# Altium project Power_Board.PrjPcb (part 3 of 3)

## Sheet Ethernet.SchDoc: =SheetTitle
size B; SheetTitle: W5500 Ethernet Controller; DrawnBy: Samyar Sadat Akhavi; SheetNumber: 7; SheetTotal: 19
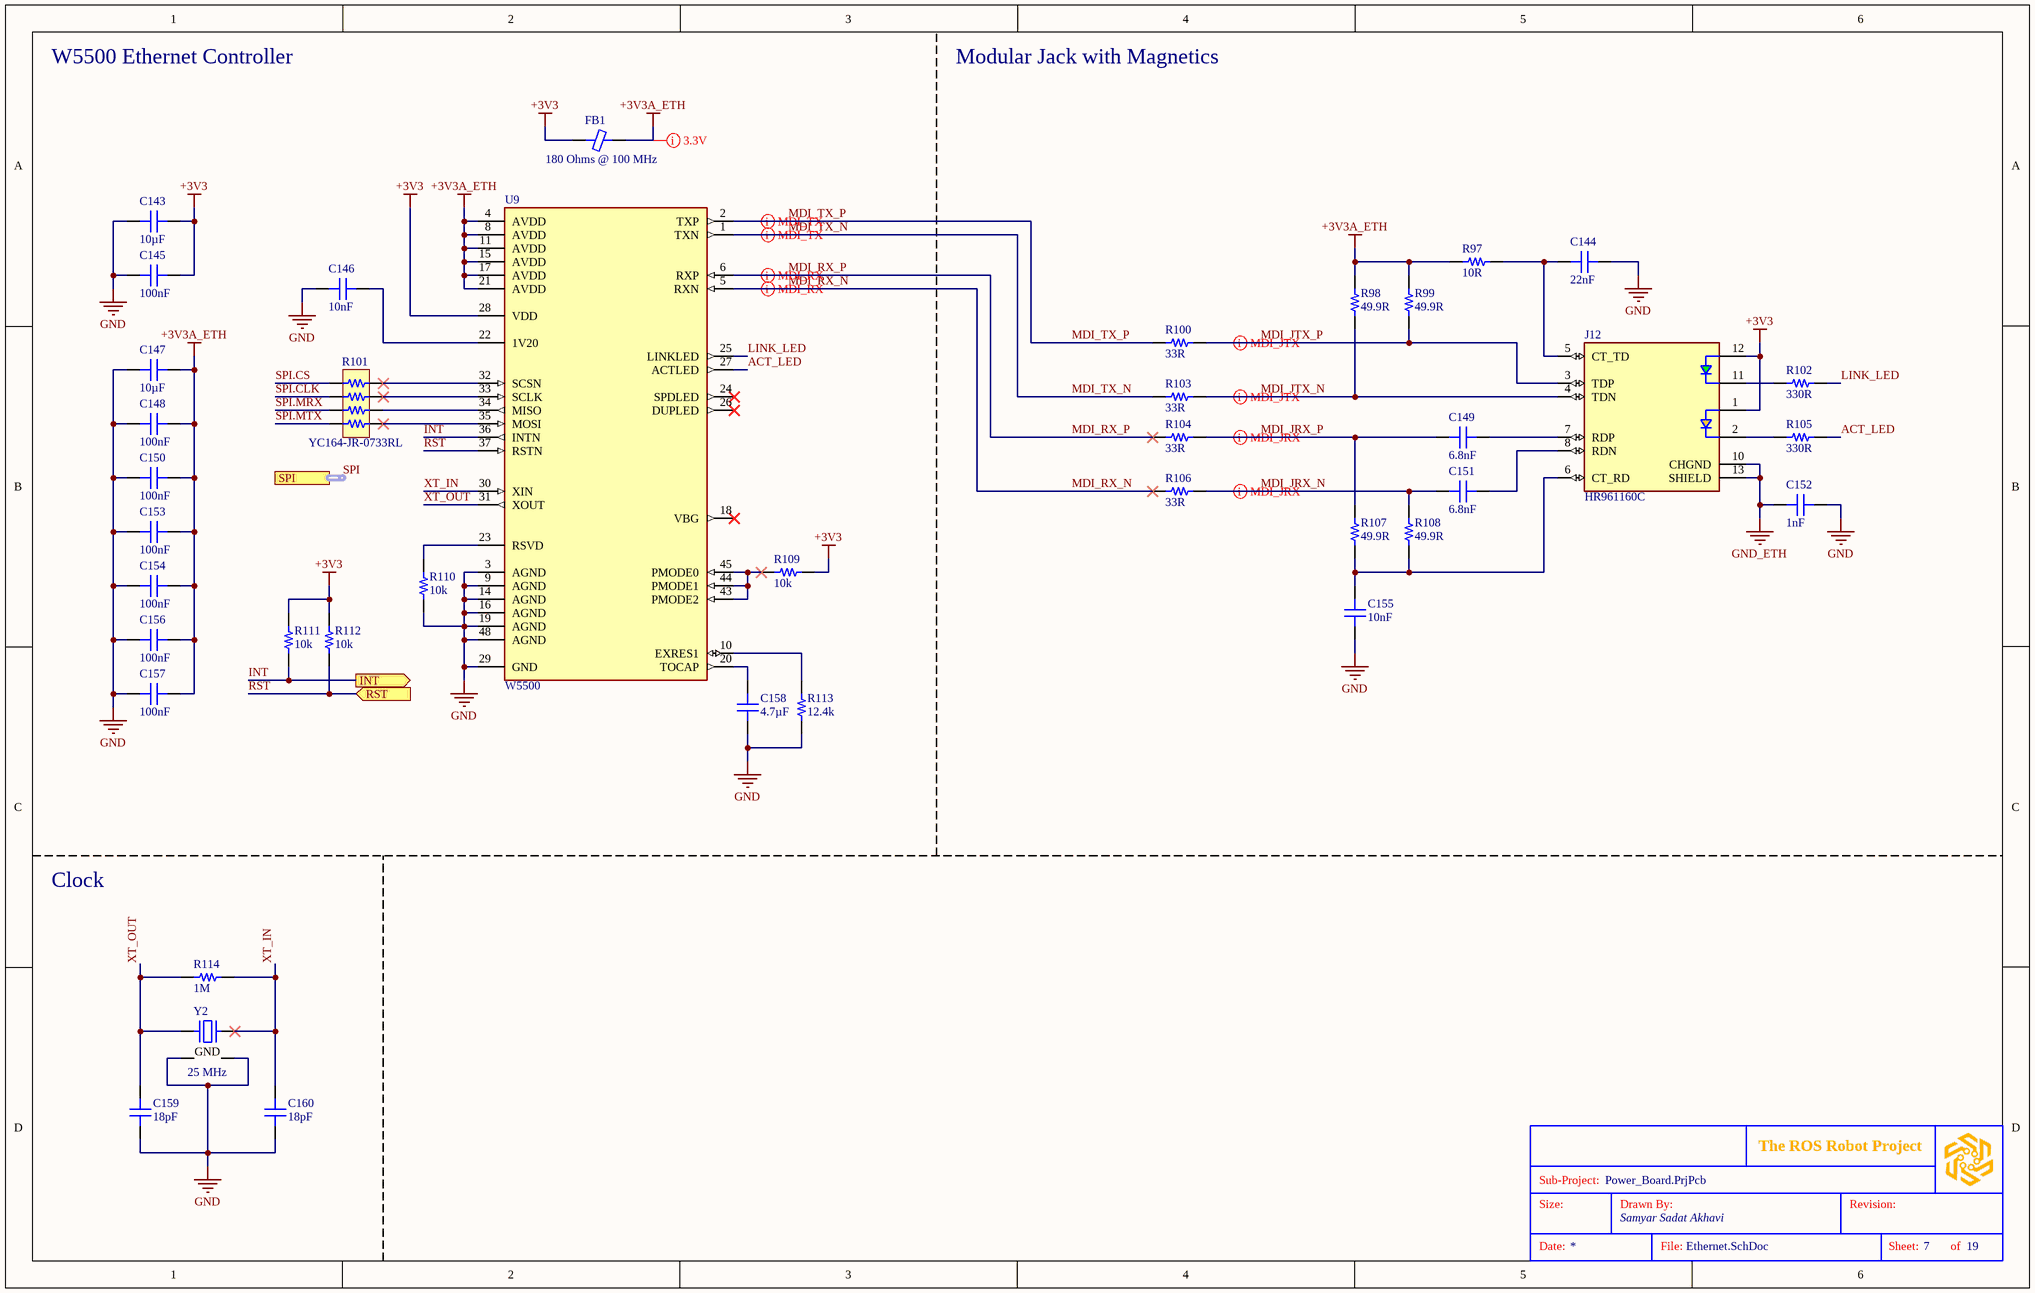
[diagram p14: Ethernet.SchDoc]

### Parts
(Parts that share a designator on the sheet are numbered #1, #2 ... from top to bottom, then left to right.)
?#12  (no value)  (graphical)
C143  10µF  [CAP 1206_3216]
C144  22nF  [CAP 0603_1608]
C145  100nF  [CAP 0603_1608]
C146  10nF  [CAP 0603_1608]
C147  10µF  [CAP 1206_3216]
C148  100nF  [CAP 0603_1608]
C149  6.8nF  [CAP 0603_1608]
C150  100nF  [CAP 0603_1608]
C151  6.8nF  [CAP 0603_1608]
C152  1nF  [CAP 1206_3216]
C153  100nF  [CAP 0603_1608]
C154  100nF  [CAP 0603_1608]
C155  10nF  [CAP 0603_1608]
C156  100nF  [CAP 0603_1608]
C157  100nF  [CAP 0603_1608]
C158  4.7µF  [CAP 0603_1608]
C159  18pF  [CAP 0603_1608]
C160  18pF  [CAP 0603_1608]
FB1  180 Ohms @ 100 MHz  [FER 0603_1608]
J12  HR961160C  [HANRUN_HR961160C]
R97  10R  [RES 0603_1608]
R98  49.9R  [RES 0603_1608]
R99  49.9R  [RES 0603_1608]
R100  33R  [RES 0603_1608]
R101  YC164-JR-0733RL  [RESNET 1206-8 CONVEX]
R102  330R  [RES 0603_1608]
R103  33R  [RES 0603_1608]
R104  33R  [RES 0603_1608]
R105  330R  [RES 0603_1608]
R106  33R  [RES 0603_1608]
R107  49.9R  [RES 0603_1608]
R108  49.9R  [RES 0603_1608]
R109  10k  [RES 0603_1608]
R110  10k  [RES 0603_1608]
R111  10k  [RES 0603_1608]
R112  10k  [RES 0603_1608]
R113  12.4k  [RES 0603_1608]
R114  1M  [RES 0603_1608]
U9  W5500  [48LQFP_W5500_WIZ]
Y2  25 MHz  [EPSON TSX-3225]

### Ports
INT (out, see Power_Board[3B]), RST (in, see Power_Board[3B]), SPI (harness SPI_FD, see Power_Board[3B])

### Nets
+3V3: C143.2 C145.1 FB1.1 J12.1(YLW_A) J12.12(GRN_A) R109.1 R111.2 R112.1 U9.28(VDD)
+3V3A_ETH: C147.2 C148.1 C150.1 C153.1 C154.1 C156.1 C157.1 FB1.2 R97.2 R98.2 R99.2 U9.4(AVDD) U9.8(AVDD) U9.11(AVDD) U9.15(AVDD) U9.17(AVDD) U9.21(AVDD)
GND: C143.1 C144.2 C145.2 C146.2 C147.1 C148.2 C150.2 C152.1 C153.2 C154.2 C155.2 C156.2 C157.2 C158.1 C159.1 C160.1 R110.2 R113.1 U9.3(AGND) U9.9(AGND) U9.14(AGND) U9.16(AGND) U9.19(AGND) U9.29(GND) U9.48(AGND) Y2.2(GND) Y2.4(GND)
GND_ETH: C152.2 J12.10(CHGND) J12.13(SHIELD)
ACT_LED: R105.2 U9.27(ACTLED)
INT: R111.1 U9.36(INTN) ; port INT
LINK_LED: R102.2 U9.25(LINKLED)
MDI_JRX_N: C151.1 R106.2 R108.2
MDI_JRX_P: C149.2 R104.2 R107.2
MDI_JTX_N: J12.4(TDN) R98.1 R103.2
MDI_JTX_P: J12.3(TDP) R99.1 R100.2
MDI_RX_N: R106.1 U9.5(RXN)
MDI_RX_P: R104.1 U9.6(RXP)
MDI_TX_N: R103.1 U9.1(TXN)
MDI_TX_P: R100.1 U9.2(TXP)
RST: R112.2 U9.37(RSTN) ; port RST
SPI.CLK: R101.2
SPI.CS: R101.1
SPI.MRX: R101.3
SPI.MTX: R101.4
XT_IN: C160.2 R114.2 U9.30(XIN) Y2.3
XT_OUT: C159.2 R114.1 U9.31(XOUT) Y2.1
NetC144_1: C144.1 J12.5(CT_TD) R97.1
NetC146_1: C146.1 U9.22(1V20)
NetC149_1: C149.1 J12.7(RDP)
NetC151_2: C151.2 J12.8(RDN)
NetC155_1: C155.1 J12.6(CT_RD) R107.1 R108.1
NetC158_2: C158.2 U9.20(TOCAP)
NetJ12_2: J12.2(YLW_K) R105.1
NetJ12_11: J12.11(GRN_K) R102.1
NetR101_5: R101.5 U9.35(MOSI)
NetR101_6: R101.6 U9.34(MISO)
NetR101_7: R101.7 U9.33(SCLK)
NetR101_8: R101.8 U9.32(SCSN)
NetR109_2: R109.2 U9.43(PMODE2) U9.44(PMODE1) U9.45(PMODE0)
NetR110_1: R110.1 U9.23(RSVD)
NetR113_2: R113.2 U9.10(EXRES1)

Not connected (* = marked no-connect by the designer): U9 18(VBG)* 24(SPDLED)* 26(DUPLED)*

### Buses and harness runs
harness SPI = port SPI

### Layout directives
differential pair: MDI_JRX_N, MDI_JRX_P, MDI_JTX_N, MDI_JTX_P, MDI_RX_N, MDI_RX_P, MDI_TX_N, MDI_TX_P
rule Supply Nets [Voltage = 3.300]: +3V3A_ETH

### Notes on the sheet
- W5500 Ethernet Controller
- Modular Jack with Magnetics
- Clock
- Sub-Project:
- Size:
- Drawn By:
- Revision:
- Date:
- File:
- Sheet:
- of

### Library data of the parts
?#12 = SGR-STDTBSB: STANDARD SCHEMATICS TITLE BLOCK
C143 C147 = GEN-CC10UT10V25KX7R1206: GENERIC 1206 MLC CAPACITOR; Tolerance: ±10%; Voltage: 25V; Dielectric: X7R; Part Number: GEN-CC10UT10V25KX7R1206; Value: 10µF
C144 = GEN-CC22NT20V25KX7R603: GENERIC 0603 MLC CAPACITOR; Tolerance: ±20%; Voltage: 25V; Dielectric: X7R; Part Number: GEN-CC22NT20V25KX7R603; Value: 22nF
C145 C148 C150 C153 C154 C156 C157 = GEN-CC100NT10V50KX7R603: GENERIC 0603 MLC CAPACITOR; Tolerance: ±10%; Voltage: 50V; Dielectric: X7R; Part Number: GEN-CC100NT10V50KX7R603; Value: 100nF
C146 C155 = GEN-CC10NT10V50KX7R603: GENERIC 0603 MLC CAPACITOR; Tolerance: ±10%; Voltage: 50V; Dielectric: X7R; Part Number: GEN-CC10NT10V50KX7R603; Value: 10nF
C149 C151 = GEN-CC6N8T10V50KX7R603: GENERIC 0603 MLC CAPACITOR; Tolerance: ±10%; Voltage: 50V; Dielectric: X7R; Part Number: GEN-CC6N8T10V50KX7R603; Value: 6.8nF
C152 = GEN-CC1NT10V2000KX7R1206: GENERIC 1206 MLC CAPACITOR; Tolerance: ±10%; Voltage: 2000V; Dielectric: X7R; Part Number: GEN-CC1NT10V2000KX7R1206; Value: 1nF
C158 = GEN-CC4U7T106V3KX7R603: GENERIC 0603 MLC CAPACITOR; Tolerance: ±10%; Voltage: 6.3V; Dielectric: X7R; Part Number: GEN-CC4U7T106V3KX7R603; Value: 4.7µF
C159 C160 = GEN-CC18PT5V50KC0G603: GENERIC 0603 MLC CAPACITOR; Tolerance: ±5%; Voltage: 50V; Dielectric: C0G; Part Number: GEN-CC18PT5V50KC0G603; Value: 18pF
FB1 = MPZ1608S181ATAH0: FERRITE BEAD 180 OHM 0603 1LN; Manufacturer: TDK Corporation; Current Rating (Max): 2A; DC Resistance (DCR) (Max): 50mOhm; Filter Type: Power Line; Number of Lines: 1; Part Number: MPZ1608S181ATAH0; ComponentLink1Description: Datasheet; ComponentLink1URL: https://product.tdk.com/info/en/catalog/datasheets/beads_commercial_power_mpz1608_en.pdf?ref_disty=digikey; ComponentLink2Description: DigiKey Link; ComponentLink2URL: https://www.digikey.com/en/products/detail/tdk-corporation/MPZ1608S181ATAH0/2117944; Device Package: 0603 (1608 Metric); Height (Max): 0.030" (0.75mm); Impedance @ Frequency: 180 Ohms @ 100 MHz; LastUpdated: 4/5/2026 8:28:05 PM; Lifecycle Status: Active; Minimum Order: 1; Mounting Type: Surface Mount; Operating Temperature: -55°C ~ 125°C; Package / Case: 0603 (1608 Metric); Packaging: TapeAndReel; PartId: 1025; Part Status: Active; Price: 0.02; Series: MPZ; Size / Dimension: 0.063" L x 0.031" W (1.60mm x 0.80mm); Supplier 1: DigiKey; Supplier Part Number 1: 445-MPZ1608S181ATAH0CT-ND; Value: 180 Ohms @ 100 MHz
J12 = HR961160C: MAGJACK SMT R/A 8P8C RJ45 ETHERNET; Manufacturer: HanRun; Part Number: HR961160C; Supplier 1: Ozdisan; Supplier Part Number 1: HR961160C
R97 = GEN-CRR10T1P8603: GENERIC 0603 CHIP RESISTOR; Tolerance: ±1%; Power: 0.125W; Part Number: GEN-CRR10T1P8603; Value: 10R
R98 R99 R107 R108 = GEN-CRR49R9T1P8603: GENERIC 0603 CHIP RESISTOR; Tolerance: ±1%; Power: 0.125W; Part Number: GEN-CRR49R9T1P8603; Value: 49.9R
R100 R103 R104 R106 = GEN-CRR33T1P8603: GENERIC 0603 CHIP RESISTOR; Tolerance: ±1%; Power: 0.125W; Part Number: GEN-CRR33T1P8603; Value: 33R
R101 = YC164-JR-0733RL: RES ARRAY 4 RES 33 OHM 1206; Manufacturer: Yageo; Circuit Type: Isolated; Number of Resistors: 4; Power Per Element: 62.5mW; Resistance (Ohms): 33; Temperature Coefficient: ±200ppm/°C; Tolerance: ±5%; Part Number: YC164-JR-0733RL; Applications: DDRAM, SDRAM; ComponentLink1Description: Datasheet; ComponentLink1URL: https://www.yageo.com/upload/media/product/productsearch/datasheet/rchip/PYu-YC_TC_group_51_RoHS_L_9.pdf; ComponentLink2Description: DigiKey Link; ComponentLink2URL: http://digikey.com/product-detail/en/yageo/YC164-JR-0733RL/YC164J-33CT-ND/1005642; Height - Seated (Max): 0.028" (0.70mm); LastUpdated: 9/2/2020 1:23:24 AM; Lifecycle Status: Active; Minimum Order: 1; Mounting Type: Surface Mount; Number of Pins: 8; Operating Temperature: -55°C ~ 155°C; Package / Case: 1206 (3216 Metric), Convex, Long Side Terminals; Packaging: TapeAndReel; PartId: 145; Part Status: Active; Price: 0.01; Series: YC164; Size / Dimension: 0.126" L x 0.063" W (3.20mm x 1.60mm); Supplier 1: DigiKey; Supplier Part Number 1: YC164J-33CT-ND
R102 R105 = GEN-CRR330T5P8603: GENERIC 0603 CHIP RESISTOR; Tolerance: ±5%; Power: 0.125W; Part Number: GEN-CRR330T5P8603; Value: 330R
R109-R112 = GEN-CRR10KT1P8603: GENERIC 0603 CHIP RESISTOR; Tolerance: ±1%; Power: 0.125W; Part Number: GEN-CRR10KT1P8603; Value: 10k
R113 = GEN-CRR12K4T1P8603: GENERIC 0603 CHIP RESISTOR; Tolerance: ±1%; Power: 0.125W; Part Number: GEN-CRR12K4T1P8603; Value: 12.4k
R114 = GEN-CRR1MT5P8603: GENERIC 0603 CHIP RESISTOR; Tolerance: ±5%; Power: 0.125W; Part Number: GEN-CRR1MT5P8603; Value: 1M
U9 = W5500: IC CTLR 3-1 ETH TCP/IP 48LQFP; Manufacturer: WIZnet; Copyright: Copyright (C) 2025 Ultra Librarian. All rights reserved.; Part Number: W5500; Supplier 1: DigiKey; Supplier Part Number 1: 1278-W5500CT-ND
Y2 = TSX-3225 25.0000MF20P-C0: CRYSTAL 25.0000MHZ 18PF SMD; Manufacturer: EPSON; ESR (Equivalent Series Resistance): 40 Ohms; Frequency Stability: ±20ppm; Frequency Tolerance: ±10ppm; Operating Mode: Fundamental; Part Number: TSX-3225 25.0000MF20P-C0; ComponentLink1Description: Datasheet; ComponentLink1URL: https://support.epson.biz/td/api/doc_check.php?dl=brief_TSX-3225&lang=en; ComponentLink2Description: DigiKey Link; ComponentLink2URL: https://www.digikey.com/en/products/detail/epson/TSX-3225-25-0000MF20P-C0/7430947; Frequency: 25 MHz; Height - Seated (Max): 0.024" (0.60mm); LastUpdated: 4/5/2026 8:41:19 PM; Lifecycle Status: Active; Load Capacitance: 18pF; Minimum Order: 1; Mounting Type: Surface Mount; Operating Temperature: -20°C ~ 85°C; Package / Case: 4-SMD, No Lead; Packaging: TapeAndReel; PartId: 447; Part Status: Active; Price: 0.21; Series: TSX-3225; Size / Dimension: 0.126" L x 0.098" W (3.20mm x 2.50mm); Supplier 1: DigiKey; Supplier Part Number 1: SER4212CT-ND; Type: MHz Crystal; Value: 25 MHz

## Sheet External_SSR.SchDoc: =SheetTitle
size A4; SheetTitle: External SSR Triggers; DrawnBy: Samyar Sadat Akhavi; SheetNumber: 8; SheetTotal: 19
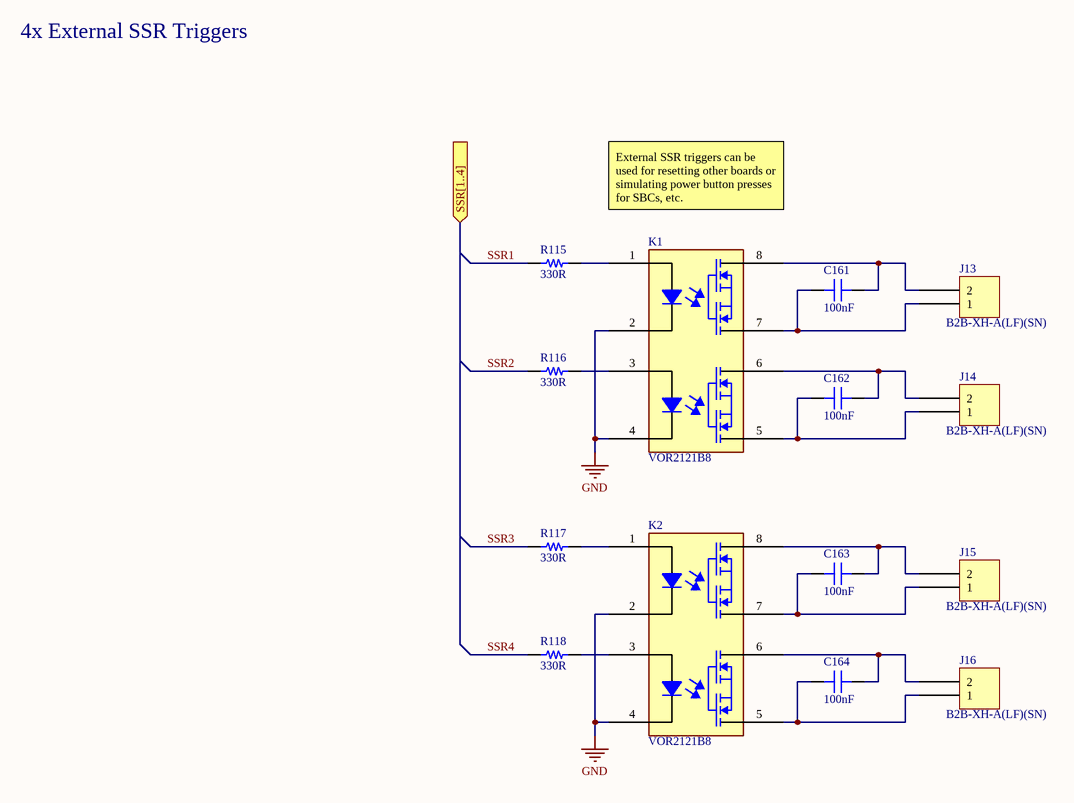
[diagram p15: External_SSR.SchDoc]

### Parts
(Parts that share a designator on the sheet are numbered #1, #2 ... from top to bottom, then left to right.)
?#13  (no value)  (graphical)
C161  100nF  [CAP 0603_1608]
C162  100nF  [CAP 0603_1608]
C163  100nF  [CAP 0603_1608]
C164  100nF  [CAP 0603_1608]
J13  B2B-XH-A(LF)(SN)  [JST XH B2B-XH-A]
J14  B2B-XH-A(LF)(SN)  [JST XH B2B-XH-A]
J15  B2B-XH-A(LF)(SN)  [JST XH B2B-XH-A]
J16  B2B-XH-A(LF)(SN)  [JST XH B2B-XH-A]
K1  VOR2121B8  [SMD-8_VOR2121B_VIS]
K2  VOR2121B8  [SMD-8_VOR2121B_VIS]
R115  330R  [RES 0603_1608]
R116  330R  [RES 0603_1608]
R117  330R  [RES 0603_1608]
R118  330R  [RES 0603_1608]

### Ports
SSR[1..4] (in, see Power_Board[3B], Microcontroller[3B])

### Nets
GND: K1.2 K1.4 K2.2 K2.4
SSR1: R115.1
SSR2: R116.1
SSR3: R117.1
SSR4: R118.1
NetC161_1: C161.1 J13.2 K1.8
NetC161_2: C161.2 J13.1 K1.7
NetC162_1: C162.1 J14.2 K1.6
NetC162_2: C162.2 J14.1 K1.5
NetC163_1: C163.1 J15.2 K2.8
NetC163_2: C163.2 J15.1 K2.7
NetC164_1: C164.1 J16.2 K2.6
NetC164_2: C164.2 J16.1 K2.5
NetK1_1: K1.1 R115.2
NetK1_3: K1.3 R116.2
NetK2_1: K2.1 R117.2
NetK2_3: K2.3 R118.2

### Notes on the sheet
- 4x External SSR Triggers
- External SSR triggers can be used for resetting other boards or simulating power button presses for SBCs, etc.
- Sub-Project:
- Size:
- Drawn By:
- Revision:
- Date:
- File:
- Sheet:
- of

### Library data of the parts
?#13 = SGR-STDTBSA4: STANDARD SCHEMATICS TITLE BLOCK
C161-C164 = GEN-CC100NT10V50KX7R603: as C145 on sheet Ethernet; Part Number: GEN-CC100NT10V50KX7R603; Value: 100nF
J13-J16 = B2B-XH-A(LF)(SN): CONN HEADER VERT 2POS 2.5MM; Manufacturer: JST Sales America Inc.; Contact Length - Post: 0.134" (3.40mm); Current Rating (Amps): 3A; Material Flammability Rating: UL94 V-0; Number of Positions: 2; Number of Positions Loaded: All; Pitch - Mating: 0.098" (2.50mm); Shrouding: Shrouded - 4 Wall; Style: Board to Cable/Wire; Voltage Rating: 250V; Part Number: B2B-XH-A(LF)(SN); ComponentLink1Description: Datasheet; ComponentLink1URL: http://www.jst-mfg.com/product/pdf/eng/eXH.pdf; ComponentLink2Description: DigiKey Link; ComponentLink2URL: http://digikey.com/product-detail/en/jst-sales-america-inc/B2B-XH-A-LF-SN/455-2247-ND/1651045; Connector Type: Header; Contact Finish - Mating: Tin; Contact Finish - Post: Tin; Contact Material: Brass; Contact Shape: Square; Contact Type: Male Pin; Fastening Type: Detent Lock; Insulation Color: Natural; Insulation Height: 0.276" (7.00mm); Insulation Material: Polyamide (PA66), Nylon 6/6; LastUpdated: 1/12/2020 11:46:08 PM; Lifecycle Status: Active; Minimum Order: 1; Mounting Type: Through Hole; Number of Rows: 1; Operating Temperature: -25°C ~ 85°C; Packaging: Bulk; PartId: 67; Part Status: Active; Price: 0.15; Series: XH; Supplier 1: DigiKey; Supplier Part Number 1: 455-2247-ND; Termination: Press-Fit, Solder
K1 K2 = VOR2121B8: SSR RELAY SPST-NO 200MA 0-250V; Manufacturer: Vishay Semiconductor Opto Division; Copyright: Copyright (C) 2026 Ultra Librarian. All rights reserved.; Part Number: VOR2121B8; Supplier 1: DigiKey; Supplier Part Number 1: VOR2121B8-ND
R115-R118 = GEN-CRR330T5P8603: as R102 on sheet Ethernet; Part Number: GEN-CRR330T5P8603; Value: 330R

## Sheet VBAT_Output.SchDoc: =SheetTitle
size A4; SheetTitle: Protected VBAT Output; DrawnBy: Samyar Sadat Akhavi; SheetNumber: 9; SheetTotal: 19
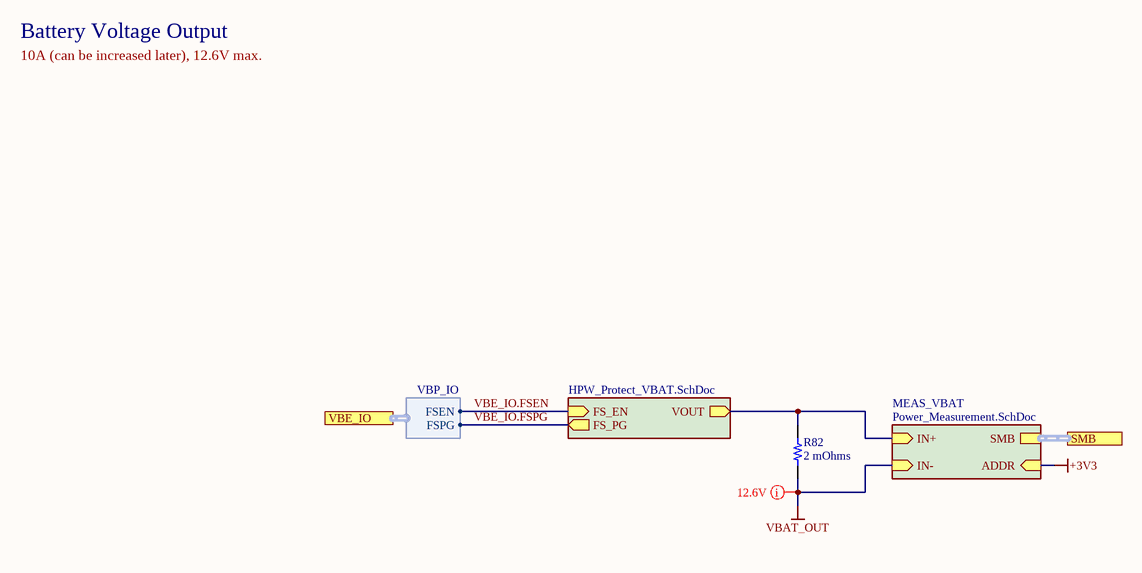
[diagram p16: VBAT_Output.SchDoc]

### Parts
(Parts that share a designator on the sheet are numbered #1, #2 ... from top to bottom, then left to right.)
?#14  (no value)  (graphical)
R82  2 mOhms  [STACKPOLE CSR2512]

### Sub-sheets
MEAS_VBAT = Power_Measurement.SchDoc: SMB (harness SMBus), ADDR (in), IN+ (in), IN- (in)
VBAT_OUT = HPW_Protect_VBAT.SchDoc: VOUT (out), FS_EN (in), FS_PG (out)

### Ports
SMB (harness SMBus, see Power_Board[3A], Battery_Input[4A], Power_Measurement[3B]), VBE_IO (harness VBP_IO, see Power_Board[3A], Microcontroller[4A])

### Harnesses
VBP_IO: FSEN, FSPG

### Nets
VBAT_OUT: R82.1 ; sheet MEAS_VBAT/IN-
VBE_IO.FSEN: sheet VBAT_OUT/FS_EN, port VBE_IO.FSEN
VBE_IO.FSPG: sheet VBAT_OUT/FS_PG, port VBE_IO.FSPG
VOUT: R82.2 ; sheet MEAS_VBAT/IN+, sheet VBAT_OUT/VOUT

### Buses and harness runs
harness port SMB = sheet MEAS_VBAT/SMB

### Layout directives
rule Supply Nets [Voltage = 12.60]: VBAT_OUT

### Notes on the sheet
- Battery Voltage Output
- 10A (can be increased later), 12.6V max.
- Sub-Project:
- Size:
- Drawn By:
- Revision:
- Date:
- File:
- Sheet:
- of

### Library data of the parts
?#14 = SGR-STDTBSA4: STANDARD SCHEMATICS TITLE BLOCK
R82 = TLR3A20DR002FTDG: RES 0.002 OHM 1% 2W 2512; Manufacturer: TE Connectivity Passive Product; Temperature Coefficient: ±50ppm/°C; Part Number: TLR3A20DR002FTDG; Package / Case: 2512 (6432 Metric); ComponentLink1Description: Datasheet; ComponentLink1URL: https://www.te.com/commerce/DocumentDelivery/DDEController?Action=srchrtrv&DocNm=1773449-3&DocType=DS&DocLang=English; ComponentLink2Description: DigiKey Link; ComponentLink2URL: http://digikey.com/product-detail/en/te-connectivity-passive-product/TLR3A20DR002FTDG/A129566CT-ND/8566770; Composition: Metal Foil; Device Package: 2512 (6432 Metric); Features: Current Sense; Height - Seated (Max): 0.024" (0.60mm); LastUpdated: 9/2/2020 1:18:06 AM; Lifecycle Status: Active; Minimum Order: 1; Number of Terminations: 2; Operating Temperature: -55°C ~ 170°C; Packaging: TapeAndReel; PartId: 1492; Part Status: Active; Power (Watts): 2W; Price: 0.30; Resistance: 2 mOhms; Series: TLR, CGS; Size / Dimension: 0.252" L x 0.126" W (6.40mm x 3.20mm); Supplier 1: DigiKey; Supplier Part Number 1: A129566CT-ND; Supplier Device Package: 2512; Tolerance: ±1%; Value: 2 mOhms

## Sheet HPW_Protect_VBAT.SchDoc: =SheetTitle
size A4; SheetTitle: High-power Bus Protection; DrawnBy: Samyar Sadat Akhavi; SheetNumber: 10; SheetTotal: 19
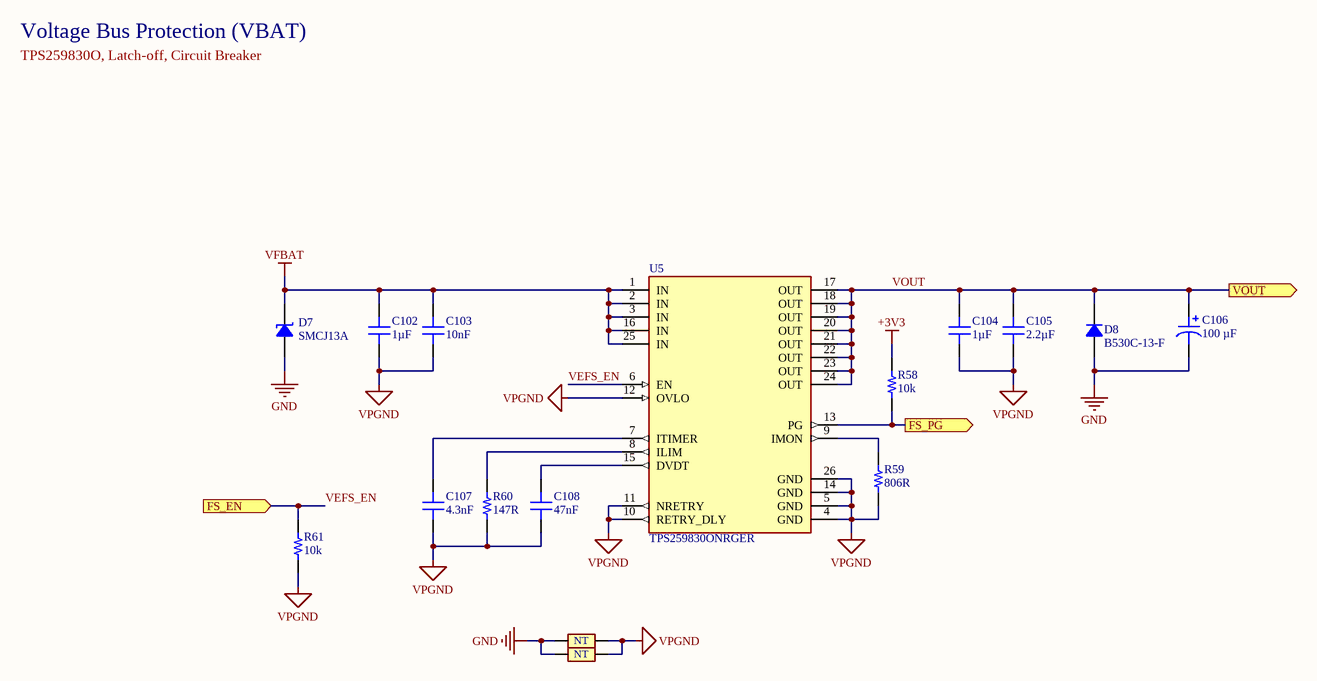
[diagram p17: HPW_Protect_VBAT.SchDoc]

### Parts
(Parts that share a designator on the sheet are numbered #1, #2 ... from top to bottom, then left to right.)
?#15  (no value)  (graphical)
C102  1µF  [CAP 0603_1608]
C103  10nF  [CAP 0603_1608]
C104  1µF  [CAP 0603_1608]
C105  2.2µF  [CAP 0805_2012]
C106  100 µF  [CAP ALSMD 6.6MM H7.7MM]
C107  4.3nF  [CAP 0603_1608]
C108  47nF  [CAP 0603_1608]
D7  SMCJ13A  [DO214AB SMC]
D8  B530C-13-F  [DO214AB SMC]
NT8  Net Tie  [Net_Tie_Via]  (value not drawn)  (net tie, no BOM)
NT9  Net Tie  [Net_Tie_Via]  (value not drawn)  (net tie, no BOM)
R58  10k  [RES 0603_1608]
R59  806R  [RES 0603_1608]
R60  147R  [RES 0603_1608]
R61  10k  [RES 0603_1608]
U5  TPS259830ONRGER  [VQFN24_RGE_TEX]

### Ports
FS_EN (in, see VBAT_Output[2B]), FS_PG (out, see VBAT_Output[2B]), VOUT (out, see VBAT_Output[2B])

### Nets
+3V3: R58.1
GND: C106.2 D7.1 D8.1 NT8.1 NT9.1
VFBAT: C102.2 C103.1 D7.2 U5.1(IN) U5.2(IN) U5.3(IN) U5.16(IN) U5.25(IN)
VPGND: C102.1 C103.2 C104.1 C105.1 C107.1 C108.1 NT8.2 NT9.2 R59.1 R60.1 R61.1 U5.4(GND) U5.5(GND) U5.10(RETRY_DLY) U5.11(NRETRY) U5.12(OVLO) U5.14(GND) U5.26(GND)
VBE_IO.FSPG: R58.2 U5.13(PG) ; port FS_PG
VEFS_EN: R61.2 U5.6(EN) ; port FS_EN  [project net VBE_IO.FSEN]
VOUT: C104.2 C105.2 C106.1 D8.2 U5.17(OUT) U5.18(OUT) U5.19(OUT) U5.20(OUT) U5.21(OUT) U5.22(OUT) U5.23(OUT) U5.24(OUT) ; port VOUT
NetC107_2: C107.2 U5.7(ITIMER)
NetC108_2: C108.2 U5.15(DVDT)
NetR59_2: R59.2 U5.9(IMON)
NetR60_2: R60.2 U5.8(ILIM)

### Notes on the sheet
- Voltage Bus Protection (VBAT)
- TPS259830O, Latch-off, Circuit Breaker
- Sub-Project:
- Size:
- Drawn By:
- Revision:
- Date:
- File:
- Sheet:
- of
- (in symbol GEN-PCBVINT0S3) NT

### Library data of the parts
?#15 = SGR-STDTBSA4: STANDARD SCHEMATICS TITLE BLOCK
C102 C104 = GEN-CC1UT10V25KX7R603: GENERIC 0603 MLC CAPACITOR; Tolerance: ±10%; Voltage: 25V; Dielectric: X7R; Part Number: GEN-CC1UT10V25KX7R603; Value: 1µF
C103 = GEN-CC10NT10V50KX7R603: as C146 on sheet Ethernet; Part Number: GEN-CC10NT10V50KX7R603; Value: 10nF
C105 = GEN-CC2U2T10V25KX7R805: GENERIC 0805 MLC CAPACITOR; Tolerance: ±10%; Voltage: 25V; Dielectric: X7R; Part Number: GEN-CC2U2T10V25KX7R805; Value: 2.2µF
C106 = 865080445010: CAP ALUM 100UF 20% 25V SMD; manufacturer: Würth Elektronik; Impedance: 380 mOhms; Lifetime @ Temp.: 2000 Hrs @ 105°C; Polarization: Polar; Ripple Current @ High Frequency: 290 mA @ 100 kHz; Ripple Current @ Low Frequency: 188.5 mA @ 120 Hz; Surface Mount Land Size: 0.260" L x 0.260" W (6.60mm x 6.60mm); Part Number: 865080445010; Applications: General Purpose; Capacitance: 100 µF; componentlink1description: Datasheet; componentlink1url: https://katalog.we-online.de/pbs/datasheet/865080445010.pdf; componentlink2description: DigiKey Link; componentlink2url: https://www.digikey.com/en/products/detail/würth-elektronik/865080445010/5728033; Device Package: Radial, Can - SMD; Height - Seated (Max): 0.303" (7.70mm); lastupdated: 4/5/2026 8:54:41 PM; Lifecycle Status: Active; Minimum Order: 1; Mounting Type: Surface Mount; Operating Temperature: -55°C ~ 105°C; Package / Case: Radial, Can - SMD; packaging: TapeAndReel; partid: 8228; Part Status: Active; price: 0.16; series: WCAP-ASLI; Size / Dimension: 0.248" Dia (6.30mm); Supplier 1: DigiKey; Supplier Part Number 1: 732-8438-1-ND; Tolerance: ±20%; value: 100 µF; Voltage - Rated: 25 V
C107 = GEN-CC4N3T5V50KC0G603: GENERIC 0603 MLC CAPACITOR; Tolerance: ±5%; Voltage: 50V; Dielectric: C0G; Part Number: GEN-CC4N3T5V50KC0G603; Value: 4.3nF
C108 = GEN-CC47NT5V25KX7R603: GENERIC 0603 MLC CAPACITOR; Tolerance: ±5%; Voltage: 25V; Dielectric: X7R; Part Number: GEN-CC47NT5V25KX7R603; Value: 47nF
D7 = SMCJ13A: TVS DIODE 13VWM 21.5VC DO214AB; Manufacturer: Littelfuse Inc.; Current - Peak Pulse (10/1000µs): 69.8A; Power Line Protection: No; Power - Peak Pulse: 1500W (1.5kW); Type: Zener; Unidirectional Channels: 1; Voltage - Breakdown (Min): 14.4V; Voltage - Clamping (Max) @ Ipp: 21.5V; Voltage - Reverse Standoff (Typ): 13V; Part Number: SMCJ13A; Applications: General Purpose; ComponentLink1Description: Datasheet; ComponentLink1URL: https://www.littelfuse.com/products/tvs-diodes/surface-mount/~/media/electronics/datasheets/tvs_diodes/littelfuse_tvs_diode_smcj_datasheet.pdf.pdf; ComponentLink2Description: DigiKey Link; ComponentLink2URL: https://www.digikey.com/en/products/detail/littelfuse-inc/SMCJ13A/762378; LastUpdated: 4/5/2026 8:33:56 PM; Lifecycle Status: Active; Minimum Order: 1; Mounting Type: Surface Mount; Operating Temperature: -55°C ~ 150°C (TJ); Package / Case: DO-214AB, SMC; Packaging: TapeAndReel; PartId: 6718; Part Status: Active; Price: 0.16; Series: SMCJ; Supplier 1: DigiKey; Supplier Part Number 1: SMCJ13ALFCT-ND; Supplier Device Package: DO-214AB (SMCJ)
D8 = B530C-13-F: DIODE SCHOTTKY 30V 5A SMC; Manufacturer: Diodes Incorporated; Capacitance @ Vr, F: 300pF @ 4V, 1MHz; Current - Reverse Leakage @ Vr: 500 µA @ 30 V; Speed: Fast Recovery =< 500ns, > 200mA (Io); Voltage - Forward (Vf) (Max) @ If: 550 mV @ 5 A; Part Number: B530C-13-F; ComponentLink1Description: Datasheet; ComponentLink1URL: https://www.diodes.com/assets/Datasheets/ds13012.pdf; ComponentLink2Description: DigiKey Link; ComponentLink2URL: https://www.digikey.com/en/products/detail/diodes-incorporated/B530C-13-F/768770; Current - Average Rectified (Io): 5A; Diode Type: Schottky; LastUpdated: 4/5/2026 8:31:14 PM; Lifecycle Status: Active; Minimum Order: 1; Mounting Type: Surface Mount; Operating Temperature - Junction: -55°C ~ 150°C; Package / Case: DO-214AB, SMC; Packaging: CutTape; PartId: 1719; Part Status: Active; Price: 0.30; Series: -; Supplier 1: DigiKey; Supplier Part Number 1: B530C-FDICT-ND; Supplier Device Package: SMC; Voltage - DC Reverse (Vr) (Max): 30 V
NT8 NT9 = GEN-PCBVINT0S3: VIA STYLE CIRCULAR NET TIE; Part Number: GEN-PCBVINT0S3; Size Variant: 0.3mm
R58 R61 = GEN-CRR10KT1P8603: as R109 on sheet Ethernet; Part Number: GEN-CRR10KT1P8603; Value: 10k
R59 = GEN-CRR806T1P8603: GENERIC 0603 CHIP RESISTOR; Tolerance: ±1%; Power: 0.125W; Part Number: GEN-CRR806T1P8603; Value: 806R
R60 = GEN-CRR147T1P8603: GENERIC 0603 CHIP RESISTOR; Tolerance: ±1%; Power: 0.125W; Part Number: GEN-CRR147T1P8603; Value: 147R
U5 = TPS259830ONRGER: 2.7-V TO 26-V, 2.7-M 18-A INTEGR; Manufacturer: Texas Instruments; Copyright: Copyright (C) 2025 Ultra Librarian. All rights reserved.; Part Number: TPS259830ONRGER; Supplier 1: DigiKey; Supplier Part Number 1: 296-TPS259830ONRGERCT-ND

## Nets that join several sheets
+3V3: Voltage_Regulators (R71.1), VOLT_REGS/PROT_3V3 (R79_PROT_3V3.1), HPW_Protect_SBC (R91.1), VOLT_REGS/MEAS_SBC (C133_MEAS_SBC.2 C134_MEAS_SBC.1 U7_MEAS_SBC.4), VOLT_REGS/MEAS_12V (C133_MEAS_12V.2 C134_MEAS_12V.1 U7_MEAS_12V.4 U7_MEAS_12V.7), VOLT_REGS/MEAS_3V3 (C133_MEAS_3V3.2 C134_MEAS_3V3.1 U7_MEAS_3V3.4), VOLT_REGS/PROT_12V (R79_PROT_12V.1), VOLT_REGS/VREG_3V3 (R22_VREG_3V3.1), VOLT_REGS/MEAS_5V (C133_MEAS_5V.2 C134_MEAS_5V.1 U7_MEAS_5V.4), VOLT_REGS/PROT_5V (R79_PROT_5V.1), VOLT_REGS/VREG_5V (R22_VREG_5V.1), Power_Reset (8 pins), Microcontroller (32 pins), BATT/MEAS_BATT (C133_MEAS_BATT.2 C134_MEAS_BATT.1 U7_MEAS_BATT.4), User_Control_IO (6 pins), Ethernet (9 pins), VBAT_OUTS/MEAS_VBAT (C133_MEAS_VBAT.2 C134_MEAS_VBAT.1 U7_MEAS_VBAT.4 U7_MEAS_VBAT.7), HPW_Protect_VBAT (R58.1)
+3V3R: Voltage_Regulators (R73.1), VOLT_REGS/MEAS_3V3 (R81_MEAS_3V3.1), Output_Connectors (C112.2 C115.2 J5.4 J6.4)
+5VR: Voltage_Regulators (R67.1), VOLT_REGS/MEAS_5V (R81_MEAS_5V.1), Output_Connectors (6 pins)
+12VR: Voltage_Regulators (R62.1), VOLT_REGS/MEAS_12V (R81_MEAS_12V.1), Output_Connectors (C121.2 C122.2 J8.3 J8.4)
GND: Power_Board (D1.2 D2.2), Voltage_Reg_12V (18 pins), Voltage_Reg_SBC (19 pins), VOLT_REGS/PROT_3V3 (5 pins), HPW_Protect_SBC (5 pins), VOLT_REGS/MEAS_SBC (C133_MEAS_SBC.1 C134_MEAS_SBC.2 U7_MEAS_SBC.3 U7_MEAS_SBC.7), VOLT_REGS/MEAS_12V (C133_MEAS_12V.1 C134_MEAS_12V.2 U7_MEAS_12V.3), VOLT_REGS/MEAS_3V3 (C133_MEAS_3V3.1 C134_MEAS_3V3.2 U7_MEAS_3V3.3), VOLT_REGS/PROT_12V (5 pins), VOLT_REGS/VREG_3V3 (15 pins), VOLT_REGS/MEAS_5V (C133_MEAS_5V.1 C134_MEAS_5V.2 U7_MEAS_5V.3), VOLT_REGS/PROT_5V (5 pins), VOLT_REGS/VREG_5V (15 pins), Power_Reset (16 pins), Microcontroller (30 pins), Battery_Input (11 pins), BATT/MEAS_BATT (C133_MEAS_BATT.1 C134_MEAS_BATT.2 U7_MEAS_BATT.3 U7_MEAS_BATT.7), Output_Connectors (28 pins), Charger_Input (7 pins), User_Control_IO (J10.4 J11.3 JP1.1), Ethernet (27 pins), External_SSR (K1.2 K1.4 K2.2 K2.4), VBAT_OUTS/MEAS_VBAT (C133_MEAS_VBAT.1 C134_MEAS_VBAT.2 U7_MEAS_VBAT.3), HPW_Protect_VBAT (5 pins)
LPGND: Voltage_Regulators (6 pins), VOLT_REGS/PROT_3V3 (9 pins), VOLT_REGS/PROT_12V (9 pins), VOLT_REGS/PROT_5V (9 pins)
VBAT: Power_Reset (F1.1), Battery_Input (10 pins), BATT/MEAS_BATT (R81_MEAS_BATT.1), Charger_Input (Q4.3)
VBAT_OUT: Output_Connectors (13 pins), VBAT_Output (R82.1), VBAT_OUTS/MEAS_VBAT (R81_MEAS_VBAT.1)
VFBAT: Voltage_Reg_12V (7 pins), Voltage_Reg_SBC (8 pins), VOLT_REGS/VREG_3V3 (5 pins), VOLT_REGS/VREG_5V (5 pins), Battery_Input (11 pins), HPW_Protect_VBAT (8 pins)
VSBC: HPW_Protect_SBC (12 pins), Output_Connectors (5 pins)
3V3PO: Voltage_Regulators (R73.2), VOLT_REGS/PROT_3V3 (C127_PROT_3V3.2 C128_PROT_3V3.1 D10_PROT_3V3.1 U6_PROT_3V3.6), VOLT_REGS/MEAS_3V3 (R80_MEAS_3V3.1)
3V3RO: Voltage_Regulators (R72.1), VOLT_REGS/PROT_3V3 (5 pins), VOLT_REGS/VREG_3V3 (6 pins)
3V3S_MEAS: Power_Reset (C81.1 D6.2 R43.2), Microcontroller (IC3.52)
5VPO: Voltage_Regulators (R67.2), VOLT_REGS/MEAS_5V (R80_MEAS_5V.1), VOLT_REGS/PROT_5V (C127_PROT_5V.2 C128_PROT_5V.1 D10_PROT_5V.1 U6_PROT_5V.6)
5VRO: Voltage_Regulators (R66.2), VOLT_REGS/PROT_5V (5 pins), VOLT_REGS/VREG_5V (6 pins)
12VPO: Voltage_Regulators (R62.2), VOLT_REGS/MEAS_12V (R80_MEAS_12V.1), VOLT_REGS/PROT_12V (C127_PROT_12V.2 C128_PROT_12V.1 D10_PROT_12V.1 U6_PROT_12V.6)
12VRO: Voltage_Reg_12V (10 pins), VOLT_REGS/PROT_12V (5 pins)
BATT_PRES: Battery_Input (J1.4), User_Control_IO (J10.3 JP1.2)
BCHG_MEAS: Microcontroller (IC3.49), Charger_Input (C71.1 D5.2 R30.2)
BEFS_EN: Microcontroller (IC3.79), Battery_Input (R25.1 U3.18)
BVBAT: Battery_Input (5 pins), BATT/MEAS_BATT (R80_MEAS_BATT.1)
CHG_EN: Microcontroller (IC3.80), Charger_Input (IC2.1 R34.2)
EN_PROT_3V3: Voltage_Regulators (R74.2), VOLT_REGS/PROT_3V3 (C131_PROT_3V3.2 R78_PROT_3V3.1 U6_PROT_3V3.1)
EN_PROT_5V: Voltage_Regulators (R68.1), VOLT_REGS/PROT_5V (C131_PROT_5V.2 R78_PROT_5V.1 U6_PROT_5V.1)
EN_PROT_12V: Voltage_Regulators (R63.1), VOLT_REGS/PROT_12V (C131_PROT_12V.2 R78_PROT_12V.1 U6_PROT_12V.1)
FBUR: Voltage_Regulators (R72.2), VOLT_REGS/VREG_3V3 (C48_VREG_3V3.1 R20_VREG_3V3.2 U2_VREG_3V3.4)
FBUR: Voltage_Regulators (R66.1), VOLT_REGS/VREG_5V (C48_VREG_5V.1 R20_VREG_5V.2 U2_VREG_5V.4)
FLT_LED: Power_Board (R2.1), Microcontroller (IC3.18)
FS_GFLT: Voltage_Regulators (R71.2), VOLT_REGS/PROT_3V3 (U6_PROT_3V3.4), VOLT_REGS/PROT_12V (U6_PROT_12V.4), VOLT_REGS/PROT_5V (U6_PROT_5V.4), Microcontroller (IC3.16)
IEN_PROT_3V3: Voltage_Regulators (R74.1 R75.2), VOLT_REGS/PROT_3V3 (U6_PROT_3V3.2)
IEN_PROT_5V: Voltage_Regulators (R68.2 R69.1), VOLT_REGS/PROT_5V (U6_PROT_5V.2)
IEN_PROT_12V: Voltage_Regulators (R63.2 R64.1), VOLT_REGS/PROT_12V (U6_PROT_12V.2)
ILM_PROT_3V3: Voltage_Regulators (R76.1), VOLT_REGS/PROT_3V3 (U6_PROT_3V3.9)
ILM_PROT_5V: Voltage_Regulators (R70.1), VOLT_REGS/PROT_5V (U6_PROT_5V.9)
ILM_PROT_12V: Voltage_Regulators (R65.2), VOLT_REGS/PROT_12V (U6_PROT_12V.9)
INT: Microcontroller (IC3.39), Ethernet (R111.1 U9.36)
RESET: Power_Reset (R44.2 S1.1), Microcontroller (IC3.35)
RST: Microcontroller (IC3.38), Ethernet (R112.2 U9.37)
SYSOK_LED: Power_Board (R1.1), Microcontroller (IC3.17)
VOUT: VBAT_Output (R82.2), VBAT_OUTS/MEAS_VBAT (R80_MEAS_VBAT.1), HPW_Protect_VBAT (12 pins)
VS_ISP: Voltage_Reg_SBC (12 pins), VOLT_REGS/MEAS_SBC (R80_MEAS_SBC.1)
VSBCRO: Voltage_Reg_SBC (5 pins), HPW_Protect_SBC (9 pins), VOLT_REGS/MEAS_SBC (R81_MEAS_SBC.1)